# EAGLE schematic Hornbill_OUR (EAGLE 6.2)
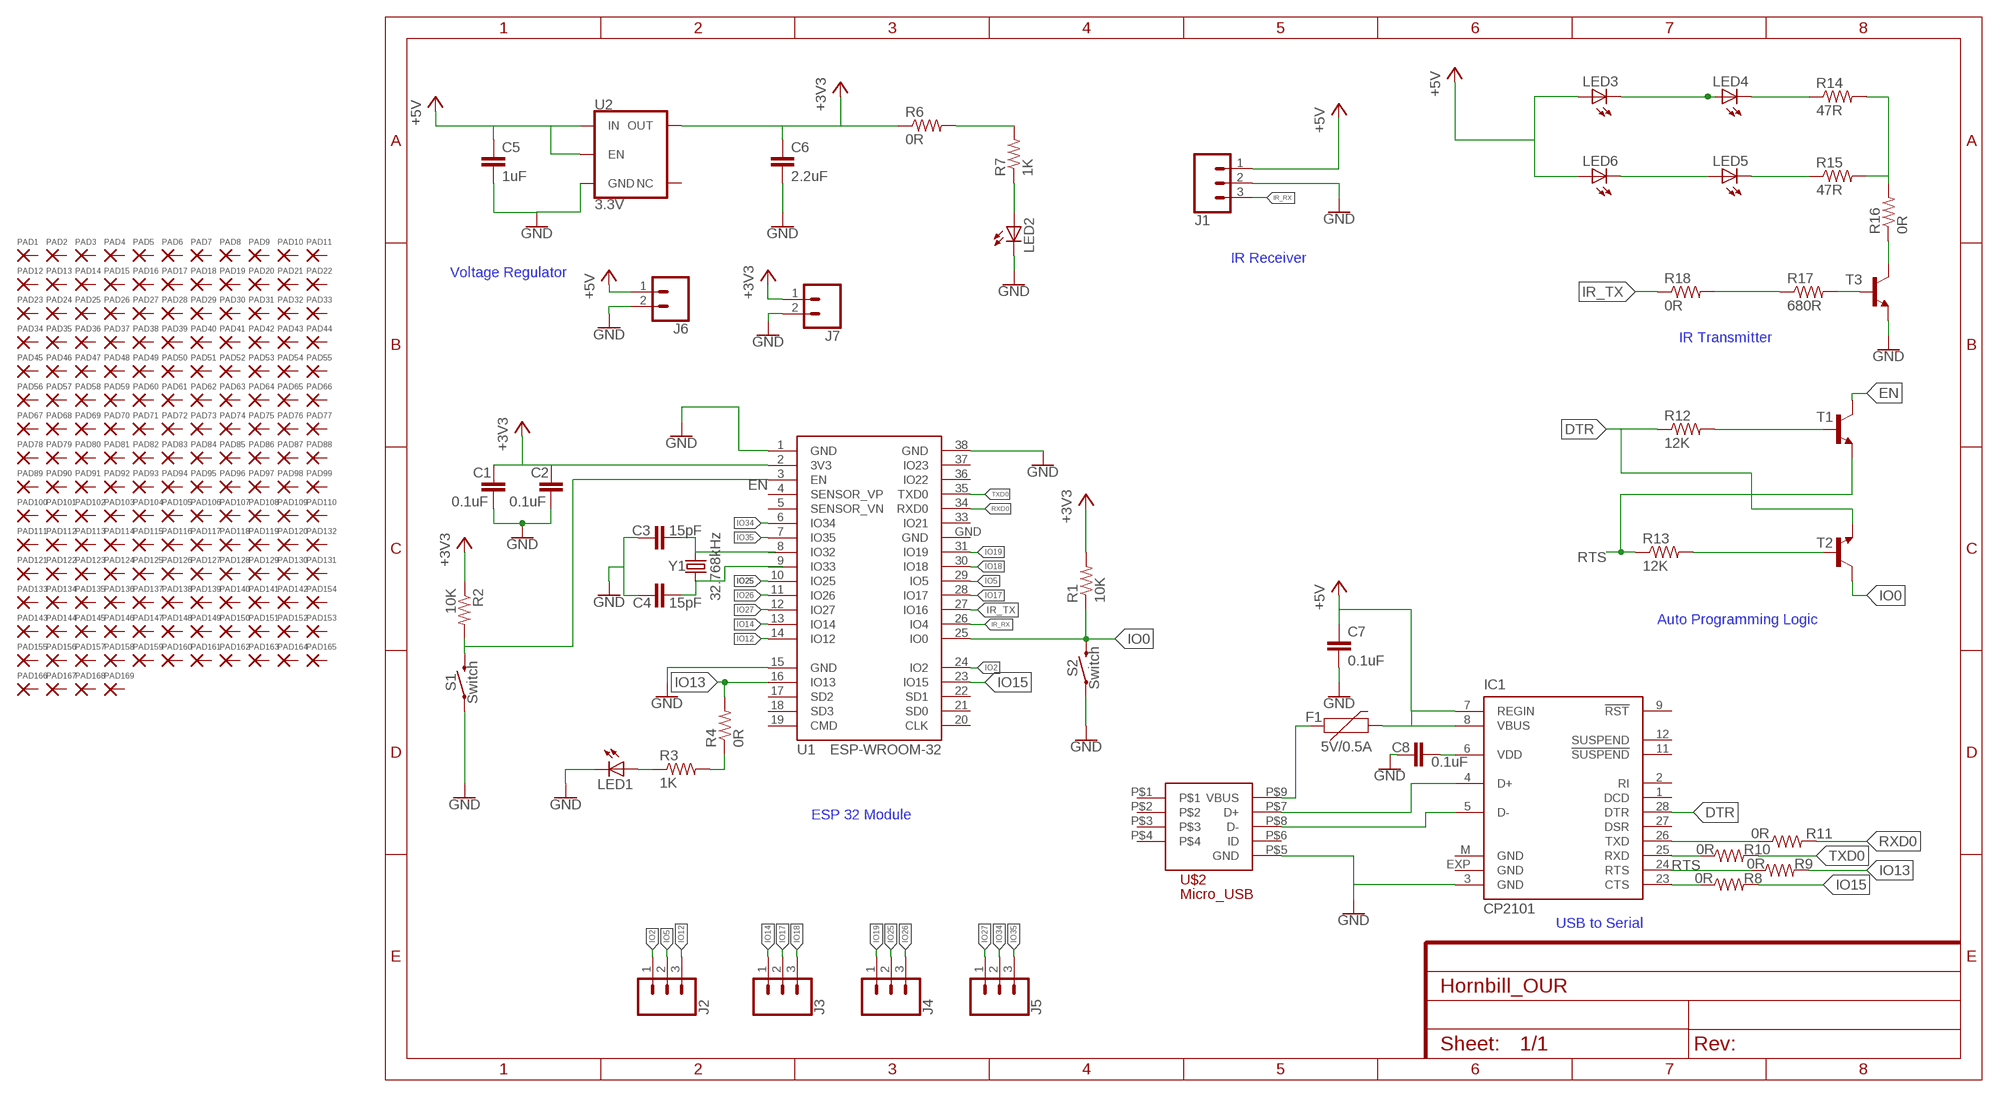
[diagram p0: schematic, sheet 1]

## Parts
C1  0.1uF  0.1UF-0603-25V-(+80/-20%)  [0603]
C2  0.1uF  0.1UF-0603-25V-(+80/-20%)  [0603]
C3  15pF  0.1UF-0603-25V-(+80/-20%)  [0603]
C4  15pF  0.1UF-0603-25V-(+80/-20%)  [0603]
C5  1uF  0.1UF-0603-25V-(+80/-20%)  [0603]
C6  2.2uF  0.1UF-0603-25V-(+80/-20%)  [0603]
C7  0.1uF  0.1UF-0603-25V-(+80/-20%)  [0603]
C8  0.1uF  0.1UF-0603-25V-(+80/-20%)  [0603]
F1  5V/0.5A  PPTC_HALF-AMP  [1206]
IC1  CP2101  CP210X_USB_UART  [MLP28]
J1  CONN_03  [1X03]
J2  CONN_03  [1X03]
J3  CONN_03  [1X03]
J4  CONN_03  [1X03]
J5  CONN_03  [1X03]
J6  CONN_02  [1X02]
J7  CONN_02  [1X02]
LED1  LEDCHIP-LED0603  [CHIP-LED0603]
LED2  LEDCHIP-LED0603  [CHIP-LED0603]
LED3  LED5MM  [LED5MM]
LED4  LED5MM  [LED5MM]
LED5  LED5MM  [LED5MM]
LED6  LED5MM  [LED5MM]
PAD1  WIREPAD2,15/1,0  [2,15/1,0]
PAD2  WIREPAD2,15/1,0  [2,15/1,0]
PAD3  WIREPAD2,15/1,0  [2,15/1,0]
PAD4  WIREPAD2,15/1,0  [2,15/1,0]
PAD5  WIREPAD2,15/1,0  [2,15/1,0]
PAD6  WIREPAD2,15/1,0  [2,15/1,0]
PAD7  WIREPAD2,15/1,0  [2,15/1,0]
PAD8  WIREPAD2,15/1,0  [2,15/1,0]
PAD9  WIREPAD2,15/1,0  [2,15/1,0]
PAD10  WIREPAD2,15/1,0  [2,15/1,0]
PAD11  WIREPAD2,15/1,0  [2,15/1,0]
PAD12  WIREPAD2,15/1,0  [2,15/1,0]
PAD13  WIREPAD2,15/1,0  [2,15/1,0]
PAD14  WIREPAD2,15/1,0  [2,15/1,0]
PAD15  WIREPAD2,15/1,0  [2,15/1,0]
PAD16  WIREPAD2,15/1,0  [2,15/1,0]
PAD17  WIREPAD2,15/1,0  [2,15/1,0]
PAD18  WIREPAD2,15/1,0  [2,15/1,0]
PAD19  WIREPAD2,15/1,0  [2,15/1,0]
PAD20  WIREPAD2,15/1,0  [2,15/1,0]
PAD21  WIREPAD2,15/1,0  [2,15/1,0]
PAD22  WIREPAD2,15/1,0  [2,15/1,0]
PAD23  WIREPAD2,15/1,0  [2,15/1,0]
PAD24  WIREPAD2,15/1,0  [2,15/1,0]
PAD25  WIREPAD2,15/1,0  [2,15/1,0]
PAD26  WIREPAD2,15/1,0  [2,15/1,0]
PAD27  WIREPAD2,15/1,0  [2,15/1,0]
PAD28  WIREPAD2,15/1,0  [2,15/1,0]
PAD29  WIREPAD2,15/1,0  [2,15/1,0]
PAD30  WIREPAD2,15/1,0  [2,15/1,0]
PAD31  WIREPAD2,15/1,0  [2,15/1,0]
PAD32  WIREPAD2,15/1,0  [2,15/1,0]
PAD33  WIREPAD2,15/1,0  [2,15/1,0]
PAD34  WIREPAD2,15/1,0  [2,15/1,0]
PAD35  WIREPAD2,15/1,0  [2,15/1,0]
PAD36  WIREPAD2,15/1,0  [2,15/1,0]
PAD37  WIREPAD2,15/1,0  [2,15/1,0]
PAD38  WIREPAD2,15/1,0  [2,15/1,0]
PAD39  WIREPAD2,15/1,0  [2,15/1,0]
PAD40  WIREPAD2,15/1,0  [2,15/1,0]
PAD41  WIREPAD2,15/1,0  [2,15/1,0]
PAD42  WIREPAD2,15/1,0  [2,15/1,0]
PAD43  WIREPAD2,15/1,0  [2,15/1,0]
PAD44  WIREPAD2,15/1,0  [2,15/1,0]
PAD45  WIREPAD2,15/1,0  [2,15/1,0]
PAD46  WIREPAD2,15/1,0  [2,15/1,0]
PAD47  WIREPAD2,15/1,0  [2,15/1,0]
PAD48  WIREPAD2,15/1,0  [2,15/1,0]
PAD49  WIREPAD2,15/1,0  [2,15/1,0]
PAD50  WIREPAD2,15/1,0  [2,15/1,0]
PAD51  WIREPAD2,15/1,0  [2,15/1,0]
PAD52  WIREPAD2,15/1,0  [2,15/1,0]
PAD53  WIREPAD2,15/1,0  [2,15/1,0]
PAD54  WIREPAD2,15/1,0  [2,15/1,0]
PAD55  WIREPAD2,15/1,0  [2,15/1,0]
PAD56  WIREPAD2,15/1,0  [2,15/1,0]
PAD57  WIREPAD2,15/1,0  [2,15/1,0]
PAD58  WIREPAD2,15/1,0  [2,15/1,0]
PAD59  WIREPAD2,15/1,0  [2,15/1,0]
PAD60  WIREPAD2,15/1,0  [2,15/1,0]
PAD61  WIREPAD2,15/1,0  [2,15/1,0]
PAD62  WIREPAD2,15/1,0  [2,15/1,0]
PAD63  WIREPAD2,15/1,0  [2,15/1,0]
PAD64  WIREPAD2,15/1,0  [2,15/1,0]
PAD65  WIREPAD2,15/1,0  [2,15/1,0]
PAD66  WIREPAD2,15/1,0  [2,15/1,0]
PAD67  WIREPAD2,15/1,0  [2,15/1,0]
PAD68  WIREPAD2,15/1,0  [2,15/1,0]
PAD69  WIREPAD2,15/1,0  [2,15/1,0]
PAD70  WIREPAD2,15/1,0  [2,15/1,0]
PAD71  WIREPAD2,15/1,0  [2,15/1,0]
PAD72  WIREPAD2,15/1,0  [2,15/1,0]
PAD73  WIREPAD2,15/1,0  [2,15/1,0]
PAD74  WIREPAD2,15/1,0  [2,15/1,0]
PAD75  WIREPAD2,15/1,0  [2,15/1,0]
PAD76  WIREPAD2,15/1,0  [2,15/1,0]
PAD77  WIREPAD2,15/1,0  [2,15/1,0]
PAD78  WIREPAD2,15/1,0  [2,15/1,0]
PAD79  WIREPAD2,15/1,0  [2,15/1,0]
PAD80  WIREPAD2,15/1,0  [2,15/1,0]
PAD81  WIREPAD2,15/1,0  [2,15/1,0]
PAD82  WIREPAD2,15/1,0  [2,15/1,0]
PAD83  WIREPAD2,15/1,0  [2,15/1,0]
PAD84  WIREPAD2,15/1,0  [2,15/1,0]
PAD85  WIREPAD2,15/1,0  [2,15/1,0]
PAD86  WIREPAD2,15/1,0  [2,15/1,0]
PAD87  WIREPAD2,15/1,0  [2,15/1,0]
PAD88  WIREPAD2,15/1,0  [2,15/1,0]
PAD89  WIREPAD2,15/1,0  [2,15/1,0]
PAD90  WIREPAD2,15/1,0  [2,15/1,0]
PAD91  WIREPAD2,15/1,0  [2,15/1,0]
PAD92  WIREPAD2,15/1,0  [2,15/1,0]
PAD93  WIREPAD2,15/1,0  [2,15/1,0]
PAD94  WIREPAD2,15/1,0  [2,15/1,0]
PAD95  WIREPAD2,15/1,0  [2,15/1,0]
PAD96  WIREPAD2,15/1,0  [2,15/1,0]
PAD97  WIREPAD2,15/1,0  [2,15/1,0]
PAD98  WIREPAD2,15/1,0  [2,15/1,0]
PAD99  WIREPAD2,15/1,0  [2,15/1,0]
PAD100  WIREPAD2,15/1,0  [2,15/1,0]
PAD101  WIREPAD2,15/1,0  [2,15/1,0]
PAD102  WIREPAD2,15/1,0  [2,15/1,0]
PAD103  WIREPAD2,15/1,0  [2,15/1,0]
PAD104  WIREPAD2,15/1,0  [2,15/1,0]
PAD105  WIREPAD2,15/1,0  [2,15/1,0]
PAD106  WIREPAD2,15/1,0  [2,15/1,0]
PAD107  WIREPAD2,15/1,0  [2,15/1,0]
PAD108  WIREPAD2,15/1,0  [2,15/1,0]
PAD109  WIREPAD2,15/1,0  [2,15/1,0]
PAD110  WIREPAD2,15/1,0  [2,15/1,0]
PAD111  WIREPAD2,15/1,0  [2,15/1,0]
PAD112  WIREPAD2,15/1,0  [2,15/1,0]
PAD113  WIREPAD2,15/1,0  [2,15/1,0]
PAD114  WIREPAD2,15/1,0  [2,15/1,0]
PAD115  WIREPAD2,15/1,0  [2,15/1,0]
PAD116  WIREPAD2,15/1,0  [2,15/1,0]
PAD117  WIREPAD2,15/1,0  [2,15/1,0]
PAD118  WIREPAD2,15/1,0  [2,15/1,0]
PAD119  WIREPAD2,15/1,0  [2,15/1,0]
PAD120  WIREPAD2,15/1,0  [2,15/1,0]
PAD121  WIREPAD2,15/1,0  [2,15/1,0]
PAD122  WIREPAD2,15/1,0  [2,15/1,0]
PAD123  WIREPAD2,15/1,0  [2,15/1,0]
PAD124  WIREPAD2,15/1,0  [2,15/1,0]
PAD125  WIREPAD2,15/1,0  [2,15/1,0]
PAD126  WIREPAD2,15/1,0  [2,15/1,0]
PAD127  WIREPAD2,15/1,0  [2,15/1,0]
PAD128  WIREPAD2,15/1,0  [2,15/1,0]
PAD129  WIREPAD2,15/1,0  [2,15/1,0]
PAD130  WIREPAD2,15/1,0  [2,15/1,0]
PAD131  WIREPAD2,15/1,0  [2,15/1,0]
PAD132  WIREPAD2,15/1,0  [2,15/1,0]
PAD133  WIREPAD2,15/1,0  [2,15/1,0]
PAD134  WIREPAD2,15/1,0  [2,15/1,0]
PAD135  WIREPAD2,15/1,0  [2,15/1,0]
PAD136  WIREPAD2,15/1,0  [2,15/1,0]
PAD137  WIREPAD2,15/1,0  [2,15/1,0]
PAD138  WIREPAD2,15/1,0  [2,15/1,0]
PAD139  WIREPAD2,15/1,0  [2,15/1,0]
PAD140  WIREPAD2,15/1,0  [2,15/1,0]
PAD141  WIREPAD2,15/1,0  [2,15/1,0]
PAD142  WIREPAD2,15/1,0  [2,15/1,0]
PAD143  WIREPAD2,15/1,0  [2,15/1,0]
PAD144  WIREPAD2,15/1,0  [2,15/1,0]
PAD145  WIREPAD2,15/1,0  [2,15/1,0]
PAD146  WIREPAD2,15/1,0  [2,15/1,0]
PAD147  WIREPAD2,15/1,0  [2,15/1,0]
PAD148  WIREPAD2,15/1,0  [2,15/1,0]
PAD149  WIREPAD2,15/1,0  [2,15/1,0]
PAD150  WIREPAD2,15/1,0  [2,15/1,0]
PAD151  WIREPAD2,15/1,0  [2,15/1,0]
PAD152  WIREPAD2,15/1,0  [2,15/1,0]
PAD153  WIREPAD2,15/1,0  [2,15/1,0]
PAD154  WIREPAD2,15/1,0  [2,15/1,0]
PAD155  WIREPAD2,15/1,0  [2,15/1,0]
PAD156  WIREPAD2,15/1,0  [2,15/1,0]
PAD157  WIREPAD2,15/1,0  [2,15/1,0]
PAD158  WIREPAD2,15/1,0  [2,15/1,0]
PAD159  WIREPAD2,15/1,0  [2,15/1,0]
PAD160  WIREPAD2,15/1,0  [2,15/1,0]
PAD161  WIREPAD2,15/1,0  [2,15/1,0]
PAD162  WIREPAD2,15/1,0  [2,15/1,0]
PAD163  WIREPAD2,15/1,0  [2,15/1,0]
PAD164  WIREPAD2,15/1,0  [2,15/1,0]
PAD165  WIREPAD2,15/1,0  [2,15/1,0]
PAD166  WIREPAD2,15/1,0  [2,15/1,0]
PAD167  WIREPAD2,15/1,0  [2,15/1,0]
PAD168  WIREPAD2,15/1,0  [2,15/1,0]
PAD169  WIREPAD2,15/1,0  [2,15/1,0]
R1  10K  R-US_R0603  [R0603]
R2  10K  R-US_R0603  [R0603]
R3  1K  R-US_R0603  [R0603]
R4  0R  R-US_R0603  [R0603]
R6  0R  R-US_R0603  [R0603]
R7  1K  R-US_R0603  [R0603]
R8  0R  R-US_R0603  [R0603]
R9  0R  R-US_R0603  [R0603]
R10  0R  R-US_R0603  [R0603]
R11  0R  R-US_R0603  [R0603]
R12  12K  R-US_R0603  [R0603]
R13  12K  R-US_R0603  [R0603]
R14  47R  R-US_R0603  [R0603]
R15  47R  R-US_R0603  [R0603]
R16  0R  R-US_R0603  [R0603]
R17  680R  R-US_R0603  [R0603]
R18  0R  R-US_R0603  [R0603]
S1  Switch  MOMENTARY-SWITCH-SPST-SMD-4.6X2.8MM  [TACTILE_SWITCH_SMD_4.6X2.8MM]
S2  Switch  MOMENTARY-SWITCH-SPST-SMD-4.6X2.8MM  [TACTILE_SWITCH_SMD_4.6X2.8MM]
T1  -NPN-SOT23-EBC  [SOT23-EBC]
T2  -NPN-SOT23-EBC  [SOT23-EBC]
T3  BC846A-NPN-SOT23-BEC  [SOT23-BEC]
U1  ESP-WROOM-32  [ESP-WROOM-32]
U2  3.3V  V_REG_AP2112K-3.3V  [SOT23-5]
U$2  MICRO_USB  [MICRO_USB]
Y1  32.768kHz  CRYSTAL-32.768KHZSMD-3.2X1.5  [CRYSTAL-SMD-3.2X1.5MM]

## Nets
+3V3: C1.1 C2.1 C6.1 J7.1 R1.2 R2.1 R6.1 U1.2(3V3) U2.5(OUT)
+5V: C5.1 C7.1 F1.2 IC1.7(REGIN) IC1.8(VBUS) J1.1 J6.1 LED3.A LED6.A U2.1(IN) U2.3(EN)
DTR: IC1.28(DTR) R12.1 T2.E
EN: R2.2 S1.3 S1.4 T1.C U1.3(EN)
GND: C1.2 C2.2 C3.1 C4.1 C5.2 C6.2 C7.2 C8.1 IC1.3(GND) J1.2 J6.2 J7.2 LED1.C LED2.C S1.1 S1.2 S2.1 S2.2 T3.E U1.1(GND) U1.15(GND) U1.38(GND) U2.2(GND) U$2.P$5(GND)
IO0: R1.1 S2.3 S2.4 T2.C U1.25(IO0)
IO2: J2.1 U1.24(IO2)
IO5: J2.2 U1.29(IO5)
IO12: J2.3 U1.14(IO12)
IO13: R4.2 R9.2 U1.16(IO13)
IO14: J3.1 U1.13(IO14)
IO15: R8.2 U1.23(IO15)
IO17: J3.2 U1.28(IO17)
IO18: J3.3 U1.30(IO18)
IO19: J4.1 U1.31(IO19)
IO25: J4.2 U1.10(IO25)
IO26: J4.3 U1.11(IO26)
IO27: J5.1 U1.12(IO27)
IO34: J5.2 U1.6(IO34)
IO35: J5.3 U1.7(IO35)
IR_RX: J1.3 U1.26(IO4)
IR_TX: R18.1 U1.27(IO16)
N$1: C3.2 U1.8(IO32) Y1.P$2
N$2: IC1.4(D+) U$2.P$7(D+)
N$3: C4.2 U1.9(IO33) Y1.P$1
N$4: IC1.5(D-) U$2.P$8(D-)
N$5: LED1.A R3.1
N$7: R3.2 R4.1
N$8: C8.2 IC1.6(VDD)
N$10: IC1.26(TXD) R11.1
N$12: R6.2 R7.2
N$13: LED2.A R7.1
N$16: F1.1 U$2.P$9(VBUS)
N$18: IC1.25(RXD) R10.1
N$20: IC1.23(CTS) R8.1
N$22: R12.2 T1.B
N$24: R13.2 T2.B
N$29: LED3.K(C) LED4.A
N$30: LED5.A LED6.K(C)
N$31: LED4.K(C) R14.1
N$32: LED5.K(C) R15.1
N$33: R14.2 R15.2 R16.2
N$34: R16.1 T3.C
N$35: R17.2 T3.B
N$36: R17.1 R18.2
RTS: IC1.24(RTS) R9.1 R13.1 T1.E
RXD0: R11.2 U1.34(RXD0)
TXD0: R10.2 U1.35(TXD0)
Unconnected: IC1.1(DCD) IC1.2(RI) IC1.9(!RST) IC1.11(!SUSPEND) IC1.12(SUSPEND) IC1.27(DSR) PAD1.1(P) PAD2.1(P) PAD3.1(P) PAD4.1(P) PAD5.1(P) PAD6.1(P) PAD7.1(P) PAD8.1(P) PAD9.1(P) PAD10.1(P) PAD11.1(P) PAD12.1(P) PAD13.1(P) PAD14.1(P) PAD15.1(P) PAD16.1(P) PAD17.1(P) PAD18.1(P) PAD19.1(P) PAD20.1(P) PAD21.1(P) PAD22.1(P) PAD23.1(P) PAD24.1(P) PAD25.1(P) PAD26.1(P) PAD27.1(P) PAD28.1(P) PAD29.1(P) PAD30.1(P) PAD31.1(P) PAD32.1(P) PAD33.1(P) PAD34.1(P) PAD35.1(P) PAD36.1(P) PAD37.1(P) PAD38.1(P) PAD39.1(P) PAD40.1(P) PAD41.1(P) PAD42.1(P) PAD43.1(P) PAD44.1(P) PAD45.1(P) PAD46.1(P) PAD47.1(P) PAD48.1(P) PAD49.1(P) PAD50.1(P) PAD51.1(P) PAD52.1(P) PAD53.1(P) PAD54.1(P) PAD55.1(P) PAD56.1(P) PAD57.1(P) PAD58.1(P) PAD59.1(P) PAD60.1(P) PAD61.1(P) PAD62.1(P) PAD63.1(P) PAD64.1(P) PAD65.1(P) PAD66.1(P) PAD67.1(P) PAD68.1(P) PAD69.1(P) PAD70.1(P) PAD71.1(P) PAD72.1(P) PAD73.1(P) PAD74.1(P) PAD75.1(P) PAD76.1(P) PAD77.1(P) PAD78.1(P) PAD79.1(P) PAD80.1(P) PAD81.1(P) PAD82.1(P) PAD83.1(P) PAD84.1(P) PAD85.1(P) PAD86.1(P) PAD87.1(P) PAD88.1(P) PAD89.1(P) PAD90.1(P) PAD91.1(P) PAD92.1(P) PAD93.1(P) PAD94.1(P) PAD95.1(P) PAD96.1(P) PAD97.1(P) PAD98.1(P) PAD99.1(P) PAD100.1(P) PAD101.1(P) PAD102.1(P) PAD103.1(P) PAD104.1(P) PAD105.1(P) PAD106.1(P) PAD107.1(P) PAD108.1(P) PAD109.1(P) PAD110.1(P) PAD111.1(P) PAD112.1(P) PAD113.1(P) PAD114.1(P) PAD115.1(P) PAD116.1(P) PAD117.1(P) PAD118.1(P) PAD119.1(P) PAD120.1(P) PAD121.1(P) PAD122.1(P) PAD123.1(P) PAD124.1(P) PAD125.1(P) PAD126.1(P) PAD127.1(P) PAD128.1(P) PAD129.1(P) PAD130.1(P) PAD131.1(P) PAD132.1(P) PAD133.1(P) PAD134.1(P) PAD135.1(P) PAD136.1(P) PAD137.1(P) PAD138.1(P) PAD139.1(P) PAD140.1(P) PAD141.1(P) PAD142.1(P) PAD143.1(P) PAD144.1(P) PAD145.1(P) PAD146.1(P) PAD147.1(P) PAD148.1(P) PAD149.1(P) PAD150.1(P) PAD151.1(P) PAD152.1(P) PAD153.1(P) PAD154.1(P) PAD155.1(P) PAD156.1(P) PAD157.1(P) PAD158.1(P) PAD159.1(P) PAD160.1(P) PAD161.1(P) PAD162.1(P) PAD163.1(P) PAD164.1(P) PAD165.1(P) PAD166.1(P) PAD167.1(P) PAD168.1(P) PAD169.1(P) U1.4(SENSOR_VP) U1.5(SENSOR_VN) U1.17(SD2) U1.18(SD3) U1.19(CMD) U1.20(CLK) U1.21(SD0) U1.22(SD1) U1.33(IO21) U1.36(IO22) U1.37(IO23) U2.4(NC) U$2.P$1 U$2.P$2 U$2.P$3 U$2.P$4 U$2.P$6(ID)

## Notes on the sheet
- IR Receiver
- Voltage Regulator
- IR Transmitter
- Auto Programming Logic
- ESP 32 Module
- USB to Serial

## Power pins joined to a net without a drawn wire
GND: IC1.EXP(GND) IC1.M(GND) U1.GND

## Library data of the parts
C1 C2 C7 C8 = SparkFun-Capacitors:0.1UF: 0.1µF ceramic capacitors A capacitor is a passive two-terminal electrical component used to store electrical energy temporarily in an electric field.; PROD_ID: CAP-00810
C3-C6 = SparkFun-Capacitors:0.1UF: 0.1µF ceramic capacitors A capacitor is a passive two-terminal electrical component used to store electrical energy temporarily in an electric field.; PROD_ID: CAP-00810; VALUE: 0.1uF
F1 = SparkFun-Fuses:PPTC: Resettable Fuse PPTC Resettable Fuse. Really a sort of resistor with a polymeric positive temperature coefficient whose resistance increases dramatically with an increase in temperature. When heated by the power passing through the resistance rises causing the current to be limited, protecting the circuit. This is achieved by the transition of the polymer from a crystalline to an amorphous state where the conductive carbon separates breaking the conductive pathways found in the cool crystalline structure. When a PPTC cools back down it resumes conducting letting the circuit turn back on. SparkFun Products: SparkFun RedBoard - Programmed with Arduino <https://www.sparkfun.com/products/12757> Pro Micro - 5V/16MHz <https://www.sparkfun.com/products/12640> Arduino Pro 328 - 5V/16MHz <https://www.sparkfun.com/products/10915> MP3 Trigger <https://www.sparkfun.com/products/13720>; PROD_ID: RES-08585; VALUE: 6V/0.5A
IC1 = SparkFun-Retired:CP210X_USB_UART: Single-Chip USB to UART Bridge Source: www.silabs.com .. CP2101.pdf / cp2102.pdf. Spark Fun Electronics SKU : COM-00310 RETIRED: IC-00865; PROD_ID: COM-00310
J1-J5 = SparkFun-Connectors:CONN_03: Multi connection point. Often used as Generic Header-pin footprint for 0.1 inch spaced/style header connections On any of the 0.1 inch spaced packages, you can populate with these: Break Away Headers - Straight <https://www.sparkfun.com/products/116> (PRT-00116) Break Away Male Headers - Right Angle <https://www.sparkfun.com/products/553> (PRT-00553) Female Headers <https://www.sparkfun.com/products/115> (PRT-00115) Break Away Headers - Machine Pin <https://www.sparkfun.com/products/117> (PRT-00117) Break Away Female Headers - Swiss Machine Pin <https://www.sparkfun.com/products/743> (PRT-00743) Stackable Header - 3 Pin (Female, 0.1") <https://www.sparkfun.com/products/13875> (PRT-13875) For SCREWTERMINALS and SPRING TERMINALS visit here: Screw Terimnals on SparkFun.com <https://www.sparkfun.com/search/results?term=Screw+Terminals> (5mm/3.5mm/2.54mm spacing) This device is also useful as a general connection point to wire up your design to another part of your project. Our various solder wires solder well into these plated through hole pads. Hook-Up Wire - Assortment (Stranded, 22 AWG) <https://www.sparkfun.com/products/11375> (PRT-11375) Hook-Up Wire - Assortment (Solid Core, 22 AWG) <https://www.sparkfun.com/products/11367> (PRT-11367) View the entire wire category on our website here <https://www.sparkfun.com/categories/141> Special notes: Molex polarized connector foot print use with SKU : PRT-08232 with associated crimp pins and housings.
J6 J7 = SparkFun-Connectors:CONN_02: Multi connection point. Often used as Generic Header-pin footprint for 0.1 inch spaced/style header connections On any of the 0.1 inch spaced packages, you can populate with these: Break Away Headers - Straight <https://www.sparkfun.com/products/116> (PRT-00116) Break Away Male Headers - Right Angle <https://www.sparkfun.com/products/553> (PRT-00553) Female Headers <https://www.sparkfun.com/products/115> (PRT-00115) Break Away Headers - Machine Pin <https://www.sparkfun.com/products/117> (PRT-00117) Break Away Female Headers - Swiss Machine Pin <https://www.sparkfun.com/products/743> (PRT-00743) For SCREWTERMINALS and SPRING TERMINALS visit here: Screw Terimnals on SparkFun.com <https://www.sparkfun.com/search/results?term=Screw+Terminals> (5mm/3.5mm/2.54mm spacing) This device is also useful as a general connection point to wire up your design to another part of your project. Our various solder wires solder well into these plated through hole pads. Hook-Up Wire - Assortment (Stranded, 22 AWG) <https://www.sparkfun.com/products/11375> (PRT-11375) Hook-Up Wire - Assortment (Solid Core, 22 AWG) <https://www.sparkfun.com/products/11367> (PRT-11367) View the entire wire category on our website here <https://www.sparkfun.com/categories/141> Special notes: Molex polarized connector foot print use with: PRT-08233 with associated crimp pins and housings. 2.54_SCREWTERM for use with PRT-10571. 3.5mm Screw Terminal footprints for PRT-08084 5mm Screw Terminal footprints for use with PRT-08432
LED1-LED6 = adafruit:LED: LED OSRAM: - CHIPLED LG R971, LG N971, LY N971, LG Q971, LY Q971, LO R971, LY R971 LH N974, LH R974 LS Q976, LO Q976, LY Q976 LO Q996 - Hyper CHIPLED LW Q18S LB Q993, LB Q99A, LB R99A - SideLED LS A670, LO A670, LY A670, LG A670, LP A670 LB A673, LV A673, LT A673, LW A673 LH A674 LY A675 LS A676, LA A676, LO A676, LY A676, LW A676 LS A679, LY A679, LG A679 - Hyper Micro SIDELED® LS Y876, LA Y876, LO Y876, LY Y876 LT Y87S - SmartLED LW L88C, LW L88S LB L89C, LB L89S, LG L890 LS L89K, LO L89K, LY L89K LS L896, LA L896, LO L896, LY L896 - TOPLED LS T670, LO T670, LY T670, LG T670, LP T670 LSG T670, LSP T670, LSY T670, LOP T670, LYG T670 LG T671, LOG T671, LSG T671 LB T673, LV T673, LT T673, LW T673 LH T674 LS T676, LA T676, LO T676, LY T676, LB T676, LH T676, LSB T676, LW T676 LB T67C, LV T67C, LT T67C, LS T67K, LO T67K, LY T67K, LW E67C LS E67B, LA E67B, LO E67B, LY E67B, LB E67C, LV E67C, LT E67C LW T67C LS T679, LY T679, LG T679 LS T770, LO T770, LY T770, LG T770, LP T770 LB T773, LV T773, LT T773, LW T773 LH T774 LS E675, LA E675, LY E675, LS T675 LS T776, LA T776, LO T776, LY T776, LB T776 LHGB T686 LT T68C, LB T68C - Hyper Mini TOPLED® LB M676 - Mini TOPLED Santana® LG M470 LS M47K, LO M47K, LY M47K Source: http://www.osram.convergy.de/
PAD1-PAD169 = wirepad:WIREPAD: Wire PAD connect wire on PCB
R1-R4 R6-R18 = adafruit:R-US_: RESISTOR, American symbol
S1 S2 = SparkFun-Switches:MOMENTARY-SWITCH-SPST: Momentary Switch (Pushbutton) - SPST Normally-open (NO) SPST momentary switches (buttons, pushbuttons). Variants PTH-12MM - 12mm square, through-hole Momentary Pushbutton Switch - 12mm Square <https://www.sparkfun.com/products/9190> (COM-09190) PTH-6.0MM, PTH-6.0MM-KIT - 6.0mm square, through-hole Mini Pushbutton Switch <https://www.sparkfun.com/products/97> (COM-00097) KIT package intended for soldering kit's - only one side of pads' copper is exposed. PTH-RIGHT-ANGLE-KIT - Right-angle, through-hole Right Angle Tactile Button <https://www.sparkfun.com/products/10791> - Used on SparkFun BigTime Watch Kit <https://www.sparkfun.com/products/11734> SMD-12MM - 12mm square, surface-mount Tactile Button - SMD (12mm) <https://www.sparkfun.com/products/12993> (COM-12993) Used on SparkFun PicoBoard <https://www.sparkfun.com/products/11888> SMD-4.5MM - 4.5mm Square Trackball Switch Used on SparkFun Blackberry Trackballer Breakout <https://www.sparkfun.com/products/13169> SMD-4.6MMX2.8MM - 4.60mm x 2.80mm, surface mount Used on SparkFun SAMD21 Mini Breakout <https://www.sparkfun.com/products/13664> SMD-5.2MM, SMD-5.2-REDUNDANT - 5.2mm square, surface-mount Mini Pushbutton Switch - SMD <https://www.sparkfun.com/products/8720> (COM-08720) Used on Arduino Pro Mini <https://www.sparkfun.com/products/11114> REDUNDANT package connects both switch circuits together SMD-6.0X3.5MM - 6.0 x 3.5mm, surface mount Momentary Reset Switch SMD <https://www.sparkfun.com/products/8229> (COM-08229) SMD-6.2MM-TALL - 6.2mm square, surface mount Tactile Button - SMD (6mm) <https://www.sparkfun.com/products/12992> Used on SparkFun Digital Sandbox <https://www.sparkfun.com/products/12651> SMD-RIGHT-ANGLE - Right-angle, surface mount Used on SparkFun Block for Intel® Edison - Arduino <https://www.sparkfun.com/products/13036>; PROD_ID: SWCH-13065
T1-T3 = transistor:*-NPN-: NPN Transistror BF959 corrected 2008.03.06
U1 = esp32:ESP-WROOM-32: Espressif Systems ESP-WROOM-32
U2 = SparkFun-IC-Power:V_REG_AP2112: AP2112 - 600mA CMOS LDO Regulator w/ Enable The AP2112 is CMOS process low dropout linear regulator with enable function, the regulator delivers a guaranteed 600mA (min.) continuous load current. Features Output Voltage Accuracy: ±1.5% Output Current: 600mA (Min.) Foldback Short Current Protection: 50mA Enable Function to Turn ON/OFF VOUT Low Dropout Voltage (3.3V): 250mV (Typ.) @IOUT=600mA Excellent Load Regulation: 0.2%/A (Typ.) Excellent Line Regulation: 0.02%/V (Typ.) Low Quiescent Current: 55μA (Typ.) Low Standby Current: 0.01μA (Typ.) Low Output Noise: 50μVRMS PSRR: 100Hz -65dB, 1kHz -65dB OTSD Protection Stable with 1.0μF Flexible Cap: Ceramic, Tantalum and Aluminum Electrolytic Operation Temperature Range: -40°C to 85°C ESD: MM 400V, HBM 4000V; PROD_ID: VREG-12457
U$2 = Micro_USB:MICRO_USB
Y1 = SparkFun-Clocks:CRYSTAL-32.768KHZ: 32.768kHz Crystal Frequency: 32.768kHz Frequency Stability: ±20ppm Load Capacitance: 12.5pF (PTH-2X6 & SMD-3.2X1.5), 6pF (SMD-2X6) SparkFun Products: SparkFun BigTime Watch Kit <https://www.sparkfun.com/products/11734> SparkFun nRF52832 Breakout <https://www.sparkfun.com/products/13990> SparkFun Real Time Clock Module <https://www.sparkfun.com/products/12708>; PROD_ID: XTAL-13062

## Net classes
0 default: width 0.381 mm, drill 0.254 mm, clearance 0.381 mm